# EAGLE design BrHalf (EAGLE 9.5.2)
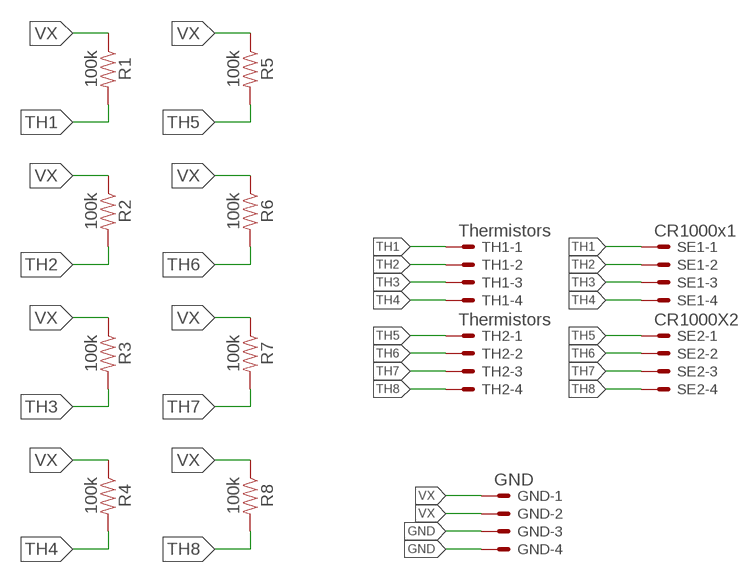
[diagram p0: schematic, sheet 1]

## Parts
GND  GND  22-23-2041  [22-23-2041]
R1  100k  100KOHM-HORIZ-1/4W-5%  [AXIAL-0.3]
R2  100k  100KOHM-HORIZ-1/4W-5%  [AXIAL-0.3]
R3  100k  100KOHM-HORIZ-1/4W-5%  [AXIAL-0.3]
R4  100k  100KOHM-HORIZ-1/4W-5%  [AXIAL-0.3]
R5  100k  100KOHM-HORIZ-1/4W-5%  [AXIAL-0.3]
R6  100k  100KOHM-HORIZ-1/4W-5%  [AXIAL-0.3]
R7  100k  100KOHM-HORIZ-1/4W-5%  [AXIAL-0.3]
R8  100k  100KOHM-HORIZ-1/4W-5%  [AXIAL-0.3]
SE1  CR1000x1  22-23-2041  [22-23-2041]
SE2  CR1000X2  22-23-2041  [22-23-2041]
TH1  Thermistors  22-23-2041  [22-23-2041]
TH2  Thermistors  22-23-2041  [22-23-2041]

## Nets
GND: GND.3 GND.4
TH1: R1.P$2 SE1.1 TH1.1
TH2: R2.P$2 SE1.2 TH1.2
TH3: R3.P$2 SE1.3 TH1.3
TH4: R4.P$2 SE1.4 TH1.4
TH5: R5.P$2 SE2.1 TH2.1
TH6: R6.P$2 SE2.2 TH2.2
TH7: R7.P$2 SE2.3 TH2.3
TH8: R8.P$2 SE2.4 TH2.4
VX: GND.1 GND.2 R1.P$1 R2.P$1 R3.P$1 R4.P$1 R5.P$1 R6.P$1 R7.P$1 R8.P$1

## Library data of the parts
GND SE1 SE2 TH1 TH2 = con-molex:22-23-2041: .100" (2.54mm) Center Header - 4 Pin; MF: MOLEX; MPN: 22-23-2041; OC_FARNELL: 1462920; OC_NEWARK: 38C0355
R1-R8 = SparkFun-Resistors:100KOHM: 100kΩ resistor A resistor is a passive two-terminal electrical component that implements electrical resistance as a circuit element. Resistors act to reduce current flow, and, at the same time, act to lower voltage levels within circuits. - Wikipedia; PROD_ID: RES-10686

## Board
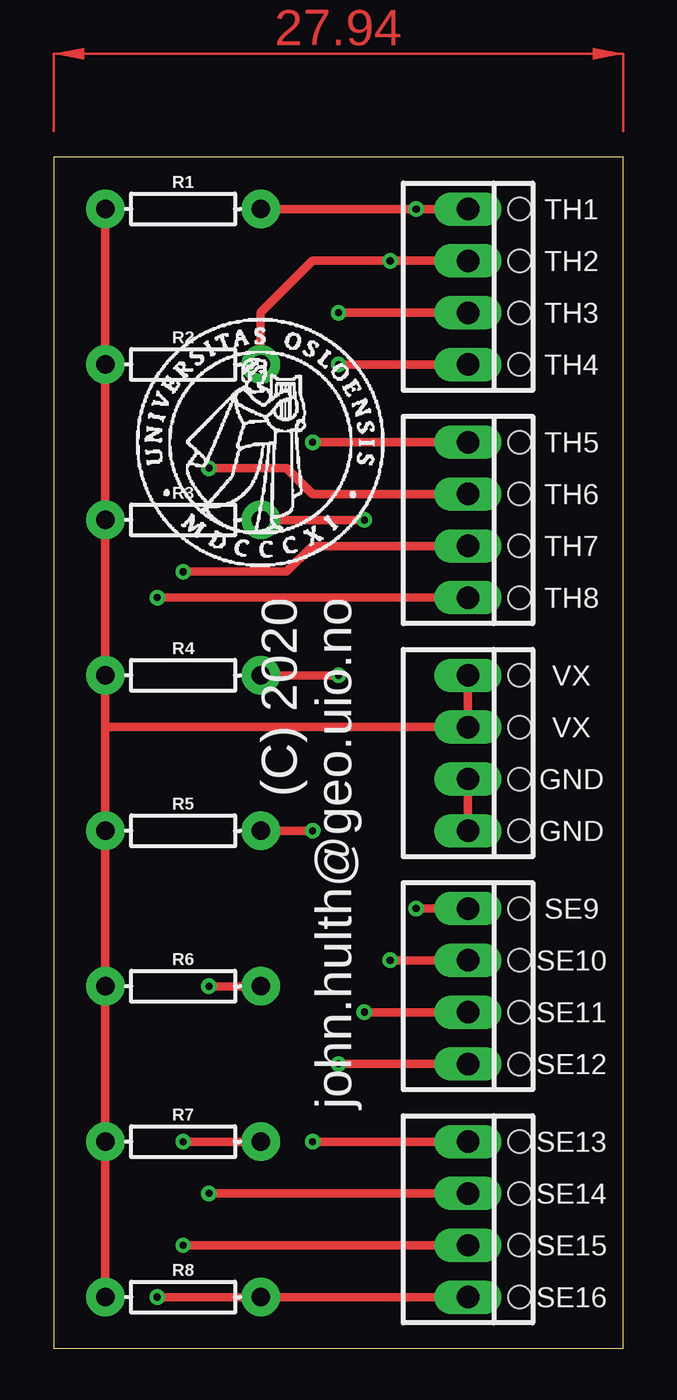
[diagram p1: board, top side]
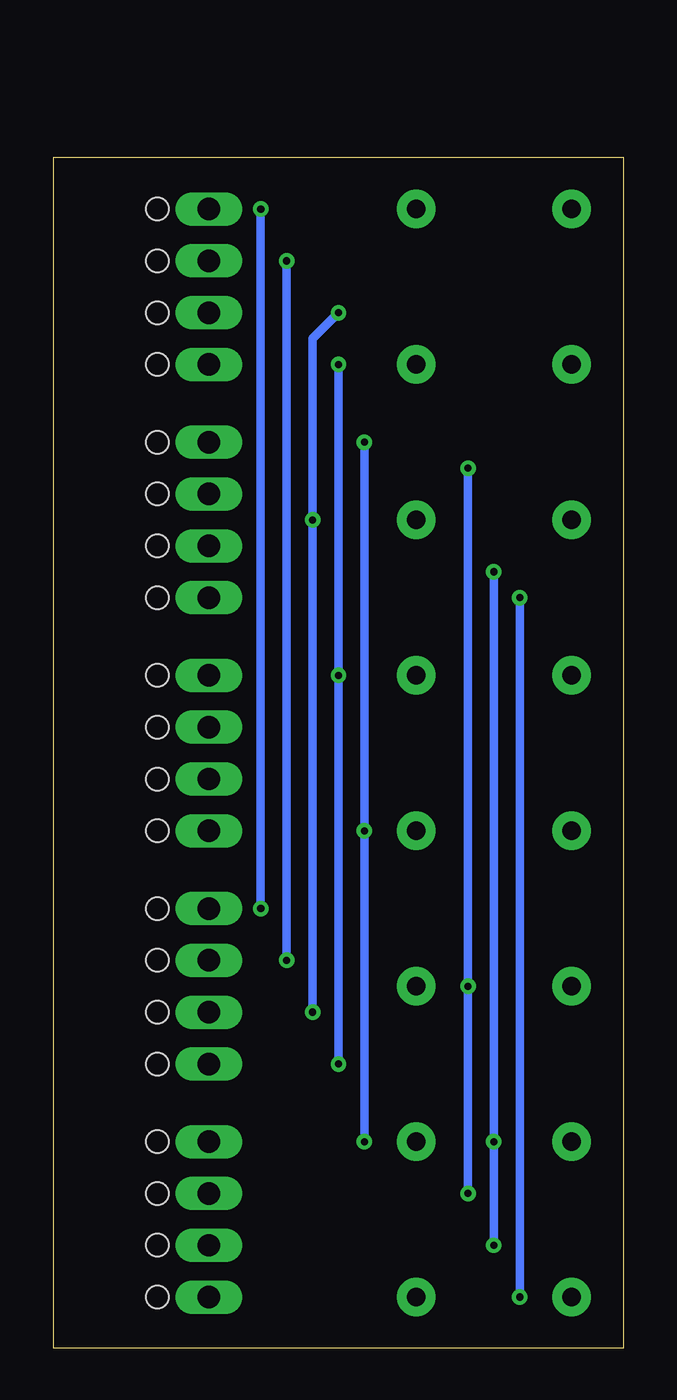
[diagram p2: board, bottom side, seen from below]

Size 27.94 x 58.4 mm. Coordinates in mm from the lower left corner, seen from the top.
Outline: 0,58.4 0,0 27.94,0 27.94,58.4 0,58.4
Copper layers (1*16): Top 0.035mm / dielectric 1.5mm / Bottom 0.035mm
Design rules "default": minimum track width 6mil, minimum drill 0.35mm, track to track 6mil, track to pad 6mil, pad to pad 6mil, via to via 6mil, smd to smd 6mil, copper to edge 40mil, drill to drill 6mil, minimum pad ring 10mil, minimum via ring 8mil, stop-mask expansion 4mil, vias tented up to drill 0mil, thermal gap 10mil

### Footprints (pad centres in the part's own frame; a part is rotated, then mirrored left to right if it is on the bottom)
22-23-2041 = drill 1.1 pad 1.422 long: 1 -3.81,0; 2 -1.27,0; 3 1.27,0; 4 3.81,0 | hole 1.1: -3.81,2.54; -1.27,2.54; 1.27,2.54; 3.81,2.54
AXIAL-0.3 = drill 0.9 pad 1.88: P$1 -3.81,0; P$2 3.81,0

### Placement (x,y rotation side)
GND  20.32,29.19 270 top
R1  6.35,55.86 0 top
R2  6.35,48.24 0 top
R3  6.35,40.62 0 top
R4  6.35,33 0 top
R5  6.35,25.38 0 top
R6  6.35,17.76 0 top
R7  6.35,10.14 0 top
R8  6.35,2.52 0 top
SE1  20.32,17.76 270 top
SE2  20.32,6.33 270 top
TH1  20.32,52.05 270 top
TH2  20.32,40.62 270 top
U$3  [UIO-LOGO-BL]  3.81,38.08 0 top

### Tracks (layer width: path | path; a pad name or v marks a point on that pad's centre or on a via)
GND
  Top 0.406: GND.3 GND.4
TH1  (via drill 0.35)
  Top 0.406: TH1.1 v17.78,55.86 R1.P$2 | v17.78,21.57 SE1.1
  Bottom 0.406: v17.78,55.86 v17.78,21.57
TH2  (via drill 0.35)
  Top 0.406: v16.51,19.03 SE1.2 | TH1.2 v16.51,53.32 12.7,53.32 10.16,50.78 R2.P$2
  Bottom 0.406: v16.51,53.32 v16.51,19.03
TH3  (via drill 0.35)
  Top 0.406: TH1.3 v13.97,50.78 | v15.24,16.49 SE1.3 | v15.24,40.62 R3.P$2
  Bottom 0.406: v13.97,50.78 15.24,49.51 v15.24,40.62 v15.24,16.49
TH4  (via drill 0.35)
  Top 0.406: TH1.4 v13.97,48.24 | v13.97,13.95 SE1.4 | v13.97,33 R4.P$2
  Bottom 0.406: v13.97,48.24 v13.97,33 v13.97,13.95
TH5  (via drill 0.35)
  Top 0.406: TH2.1 v12.7,44.43 | v12.7,10.14 SE2.1 | v12.7,25.38 R5.P$2
  Bottom 0.406: v12.7,44.43 v12.7,25.38 v12.7,10.14
TH6  (via drill 0.35)
  Top 0.406: TH2.2 12.7,41.89 11.43,43.16 v7.62,43.16 | v7.62,7.6 SE2.2 | v7.62,17.76 R6.P$2
  Bottom 0.406: v7.62,43.16 v7.62,17.76 v7.62,7.6
TH7  (via drill 0.35)
  Top 0.406: TH2.3 12.7,39.35 11.43,38.08 v6.35,38.08 | v6.35,5.06 SE2.3 | v6.35,10.14 R7.P$2
  Bottom 0.406: v6.35,38.08 v6.35,10.14 v6.35,5.06
TH8  (via drill 0.35)
  Top 0.406: TH2.4 v5.08,36.81 | SE2.4 v5.08,2.52 R8.P$2
  Bottom 0.406: v5.08,36.81 v5.08,2.52
VX
  Top 0.406: 2.54,30.46 GND.2 GND.1 | R1.P$1 R2.P$1 R3.P$1 R4.P$1 2.54,30.46 | R8.P$1 R7.P$1 R6.P$1 R5.P$1 2.54,30.46
(copper drawn outside any net)
  shapes: Top area x2

### Text on the board
tPlace: TH1 | TH2 | TH3 | TH4 | TH5 | TH6 | TH7 | TH8 | VX | VX | GND | GND | SE9 | SE10 | SE11 | SE12 | SE13 | SE14 | SE15 | SE16
tNames: (C) 2020 / john.hulth@geo.uio.no